# EAGLE schematic Interface (EAGLE 6.4)
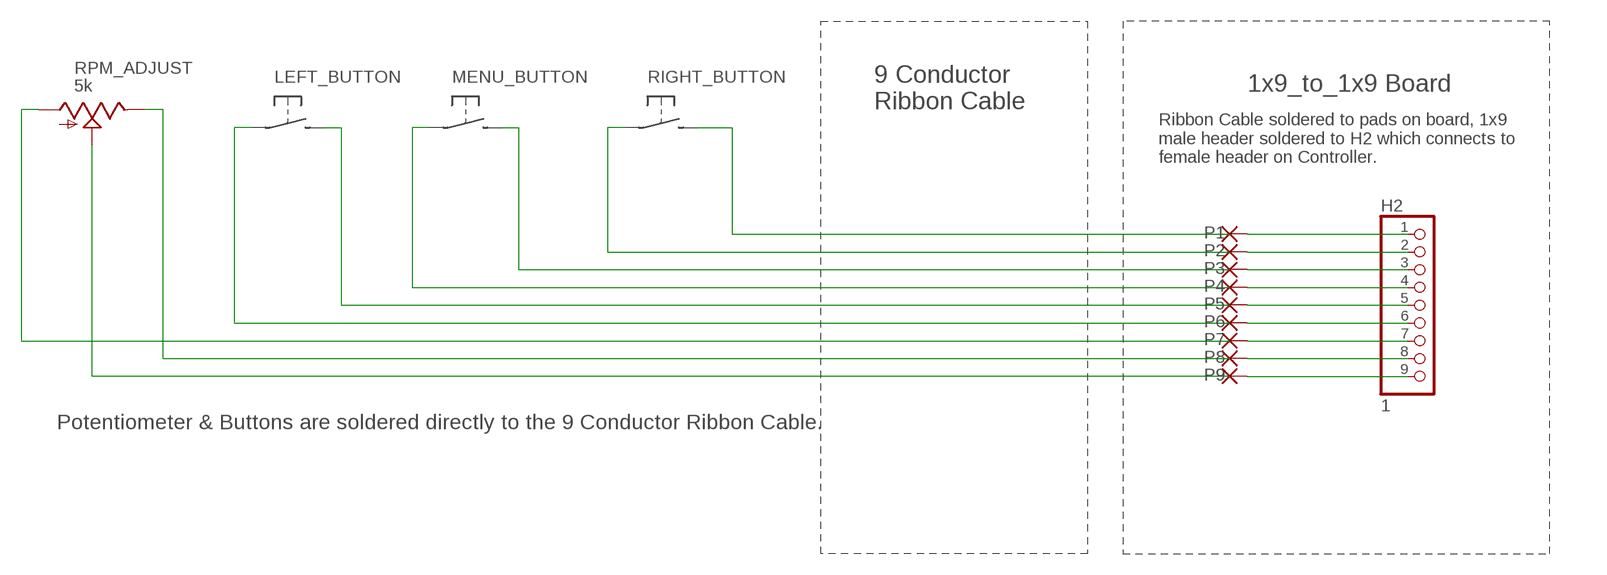
[diagram p0: schematic, sheet 1]

## Parts
H2  1  PINHD-1X9  [1X09]
P1  1,6/0,9  [1,6/0,9]
P2  1,6/0,9  [1,6/0,9]
P3  1,6/0,9  [1,6/0,9]
P4  1,6/0,9  [1,6/0,9]
P5  1,6/0,9  [1,6/0,9]
P6  1,6/0,9  [1,6/0,9]
P7  1,6/0,9  [1,6/0,9]
P8  1,6/0,9  [1,6/0,9]
P9  1,6/0,9  [1,6/0,9]
RPM_ADJUST  5k  TRIM_US-CIP20C-6MM  [CIP20C-6MM]

## Nets
N$1: RPM_ADJUST.S
N$2: RPM_ADJUST.E
N$3: RPM_ADJUST.A
S$1: H2.1 P1.1(P)
S$2: H2.2 P2.1(P)
S$3: H2.3 P3.1(P)
S$4: H2.4 P4.1(P)
S$5: H2.5 P5.1(P)
S$6: H2.6 P6.1(P)
S$7: H2.7 P7.1(P)
S$8: H2.8 P8.1(P)
S$9: H2.9 P9.1(P)

## Notes on the sheet
- 1x9_to_1x9 Board
- 9 Conductor
  Ribbon Cable
- Ribbon Cable soldered to pads on board, 1x9
  male header soldered to H2 which connects to
  female header on Controller.
- Potentiometer & Buttons are soldered directly to the 9 Conductor Ribbon Cable.

## Library data of the parts
H2 = pinhead:PINHD-1X9: PIN HEADER
P1-P9 = wirepad:1,6/0,9: THROUGH-HOLE PAD
RPM_ADJUST = pot:TRIM_US-: POTENTIOMETER